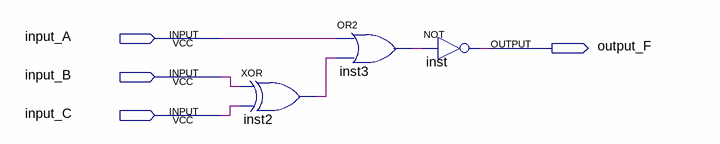
[diagram p0: schematic sheet]
// Quartus schematic TaskVar12.bdf as structural Verilog: 3 symbols, 4 pins
module TaskVar12 (
  input  input_A,
  input  input_B,
  input  input_C,
  output output_F
);

  wire inst2_out, inst3_out;

  xor inst2 (inst2_out, input_B, input_C);
  or inst3 (inst3_out, input_A, inst2_out);
  not inst (output_F, inst3_out);
endmodule
